# EAGLE design MAX11609EEE-Breakout-Board-doubleHeaders (EAGLE 6.5.0)
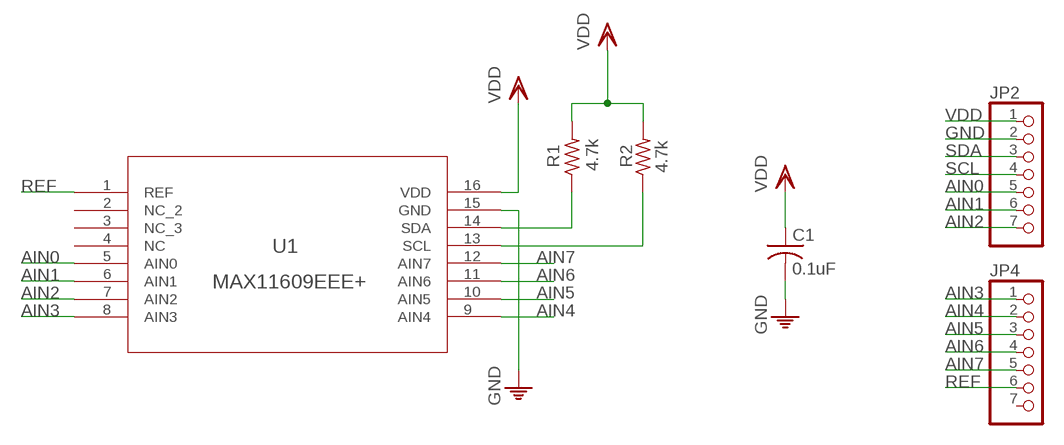
[diagram p0: schematic, sheet 1]

## Parts
C1  0.1uF  C-USC0805  [C0805]
JP2  PINHD-1X7  [1X07]
JP4  PINHD-1X7  [1X07]
R1  4.7k  R-US_R0805  [R0805]
R2  4.7k  R-US_R0805  [R0805]
U1  MAX11609EEE+  [21-0055H_16]

## Nets
AIN0: JP2.5 U1.5(AIN0)
AIN1: JP2.6 U1.6(AIN1)
AIN2: JP2.7 U1.7(AIN2)
AIN3: JP4.1 U1.8(AIN3)
AIN4: JP4.2 U1.9(AIN4)
AIN5: JP4.3 U1.10(AIN5)
AIN6: JP4.4 U1.11(AIN6)
AIN7: JP4.5 U1.12(AIN7)
GND: C1.2 JP2.2 U1.15(GND)
REF: JP4.6 U1.1(REF)
SCL: JP2.4 R2.1 U1.13(SCL)
SDA: JP2.3 R1.1 U1.14(SDA)
VDD: C1.1 JP2.1 R1.2 R2.2 U1.16(VDD)
Unconnected: JP4.7 U1.2(NC_2) U1.3(NC_3) U1.4(NC)

## Library data of the parts
C1 = resistor:C-US: CAPACITOR, American symbol
JP2 JP4 = pinhead:PINHD-1X7: PIN HEADER
R1 R2 = resistor:R-US_: RESISTOR, American symbol
U1 = MAX11609EEE:MAX11609EEE+; MANUFACTURER_NAME: Maxim; MANUFACTURER_PART_NUMBER: MAX11609EEE+; VENDOR: Maxim

## Board
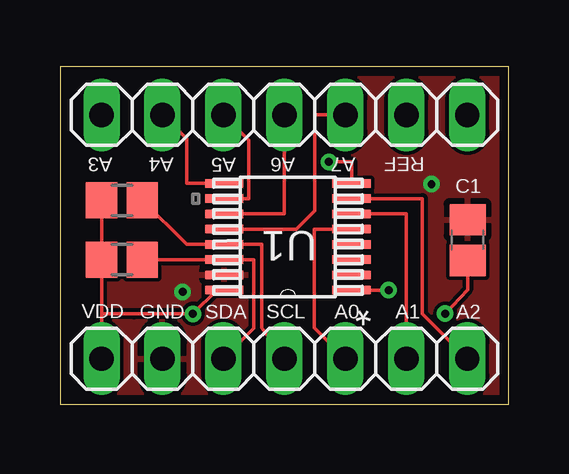
[diagram p1: board, top side]
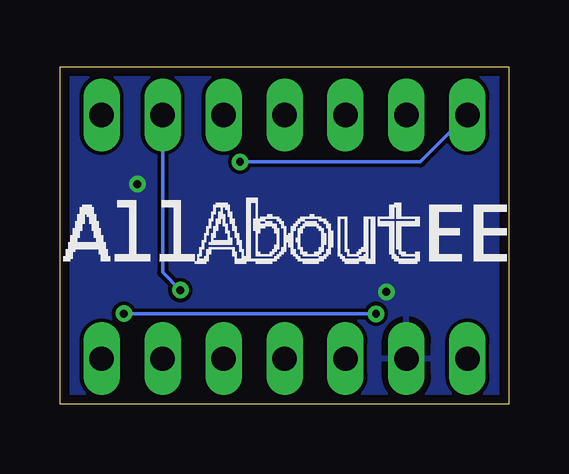
[diagram p2: board, bottom side, seen from below]

Size 18.7 x 14.06 mm. Coordinates in mm from the lower left corner, seen from the top.
Outline: 0.01,0 18.71,0 18.7,14.06 0,14.06 0.01,0
Copper layers (1*16): Top 0.0356mm / dielectric 1.5011mm / Bottom 0.0356mm
Design rules "oshpark": minimum track width 6mil, minimum drill 13mil, track to track 6mil, track to pad 6mil, pad to pad 6mil, via to via 6mil, smd to smd 6mil, copper to edge 15mil, drill to drill 6mil, minimum pad ring 7mil, minimum via ring 7mil, stop-mask expansion 3mil, vias tented up to drill 0mil, thermal gap 10mil

### Footprints (pad centres in the part's own frame; a part is rotated, then mirrored left to right if it is on the bottom)
C0805 = smd 1.3 x 1.5: 1 -0.85,0; 2 0.85,0
1X07 = drill 1.016 long: 1 -7.62,0; 2 -5.08,0; 3 -2.54,0; 4 0,0; 5 2.54,0; 6 5.08,0; 7 7.62,0
R0805 = smd 1.3 x 1.5: 1 -0.85,0; 2 0.85,0
21-0055H_16 = smd 1.6 x 0.356: 1 -2.654,2.223; 2 -2.654,1.587; 3 -2.654,0.953; 4 -2.654,0.318; 5 -2.654,-0.318; 6 -2.654,-0.953; 7 -2.654,-1.587; 8 -2.654,-2.223; 9 2.654,-2.223; 10 2.654,-1.587; 11 2.654,-0.953; 12 2.654,-0.318; 13 2.654,0.318; 14 2.654,0.953; 15 2.654,1.587; 16 2.654,2.223

### Placement (x,y rotation side)
C1  16.98,6.85 90 top
JP2  9.35,1.91 0 top
JP4  9.35,12.07 0 top
R1  2.58,6.04 180 top
R2  2.58,8.51 180 top
U1  9.5,6.99 180 top

### Tracks (layer width: path | path; a pad name or v marks a point on that pad's centre or on a via)
AIN0
  Top 0.152: U1.5 10.6,7.3 10.6,3.19 JP2.5
AIN1
  Top 0.152: U1.6 14.43,7.94 JP2.6
AIN2
  Top 0.152: U1.7 15.09,8.57 15.09,3.78 JP2.7
AIN3  (via drill 0.33)
  Top 0.152: v11.2,10.11 12.16,10.11 U1.8
  Bottom 0.152: JP4.1 3.69,10.11 v11.2,10.11
AIN4
  Top 0.152: JP4.2 5.27,11.07 5.27,9.21 U1.9
AIN5
  Top 0.152: JP4.3 7.87,11 7.87,8.57 U1.10
AIN6
  Top 0.152: U1.11 9.35,7.94 JP4.4
AIN7
  Top 0.152: JP4.5 10.62,12.07 10.62,8.08 9.85,7.3 U1.12
GND  (via drill 0.33)
  other vias: 5.11,4.69 15.48,9.18
  pour Top: -0.63,-0.76 19.31,-0.76 19.31,16.64 -0.63,16.64
  pour Bottom: -0.38,16.38 19.18,16.38 19.18,-0.64 -0.38,-0.64
REF  (via drill 0.33)
  Top 0.152: v13.69,4.76 U1.1
  Bottom 0.152: JP4.6 14.43,5.5 v13.69,4.76
SCL
  Top 0.152: JP2.4 8.42,3.19 8.42,6.67 U1.13 5.27,6.68 R2.1
SDA
  Top 0.152: JP2.3 8.07,3.17 8.07,6.03 U1.14 R1.1
VDD  (via drill 0.33)
  Top 0.152: R2.2 R1.2 1.73,3.78 | 1.73,3.78 3.08,3.78 v5.54,3.78 6.53,4.76 U1.16 | 1.73,3.78 JP2.1 | C1.1 16.98,4.78 v16.05,3.79
  Bottom 0.152: v16.05,3.79 v5.54,3.78

### Text on the board
tPlace: A3 | A4 | A5 | A6 | A7 | REF | VDD | GND | SDA | SCL | A0 | A1 | A2